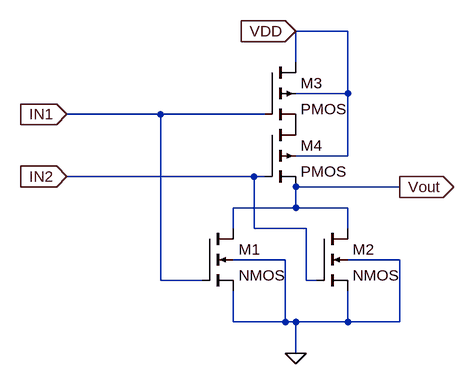
[diagram p0: schematic NOR2.asc]
NOR2.asc, the LTspice schematic file:
Version 4.1
SHEET 1 880 680
WIRE 352 0 272 0
WIRE 272 48 272 0
WIRE 352 96 352 0
WIRE 352 96 272 96
WIRE 64 128 -80 128
WIRE 224 128 64 128
WIRE 352 192 352 96
WIRE 352 192 272 192
WIRE 208 224 -80 224
WIRE 224 224 208 224
WIRE 432 240 272 240
WIRE 272 272 272 240
WIRE 272 272 176 272
WIRE 352 272 272 272
WIRE 176 304 176 272
WIRE 208 304 208 224
WIRE 288 304 208 304
WIRE 352 304 352 272
WIRE 256 352 176 352
WIRE 432 352 352 352
WIRE 64 384 64 128
WIRE 128 384 64 384
WIRE 288 384 288 304
WIRE 304 384 288 384
WIRE 176 448 176 400
WIRE 256 448 256 352
WIRE 256 448 176 448
WIRE 272 448 256 448
WIRE 352 448 352 400
WIRE 352 448 272 448
WIRE 432 448 432 352
WIRE 432 448 352 448
WIRE 272 496 272 448
FLAG 272 496 0
FLAG 432 240 Vout
IOPIN 432 240 Out
FLAG 272 0 VDD
IOPIN 272 0 In
FLAG -80 128 IN1
IOPIN -80 128 In
FLAG -80 224 IN2
IOPIN -80 224 In
SYMBOL nmos4 128 304 R0
SYMATTR InstName M1
SYMBOL nmos4 304 304 R0
SYMATTR InstName M2
SYMBOL pmos4 224 48 R0
SYMATTR InstName M3
SYMBOL pmos4 224 144 R0
SYMATTR InstName M4

The netlist it stands for:
* NOR2.asc
M1 Vout IN1 0 0 NMOS
M2 Vout IN2 0 0 NMOS
M3 VDD IN1 P001 VDD PMOS
M4 P001 IN2 Vout VDD PMOS
.model NMOS NMOS
.model PMOS PMOS
.lib standard.mos
.backanno
.end